# Altium schematic sheet Controller_v6.1.SchDoc
size Letter
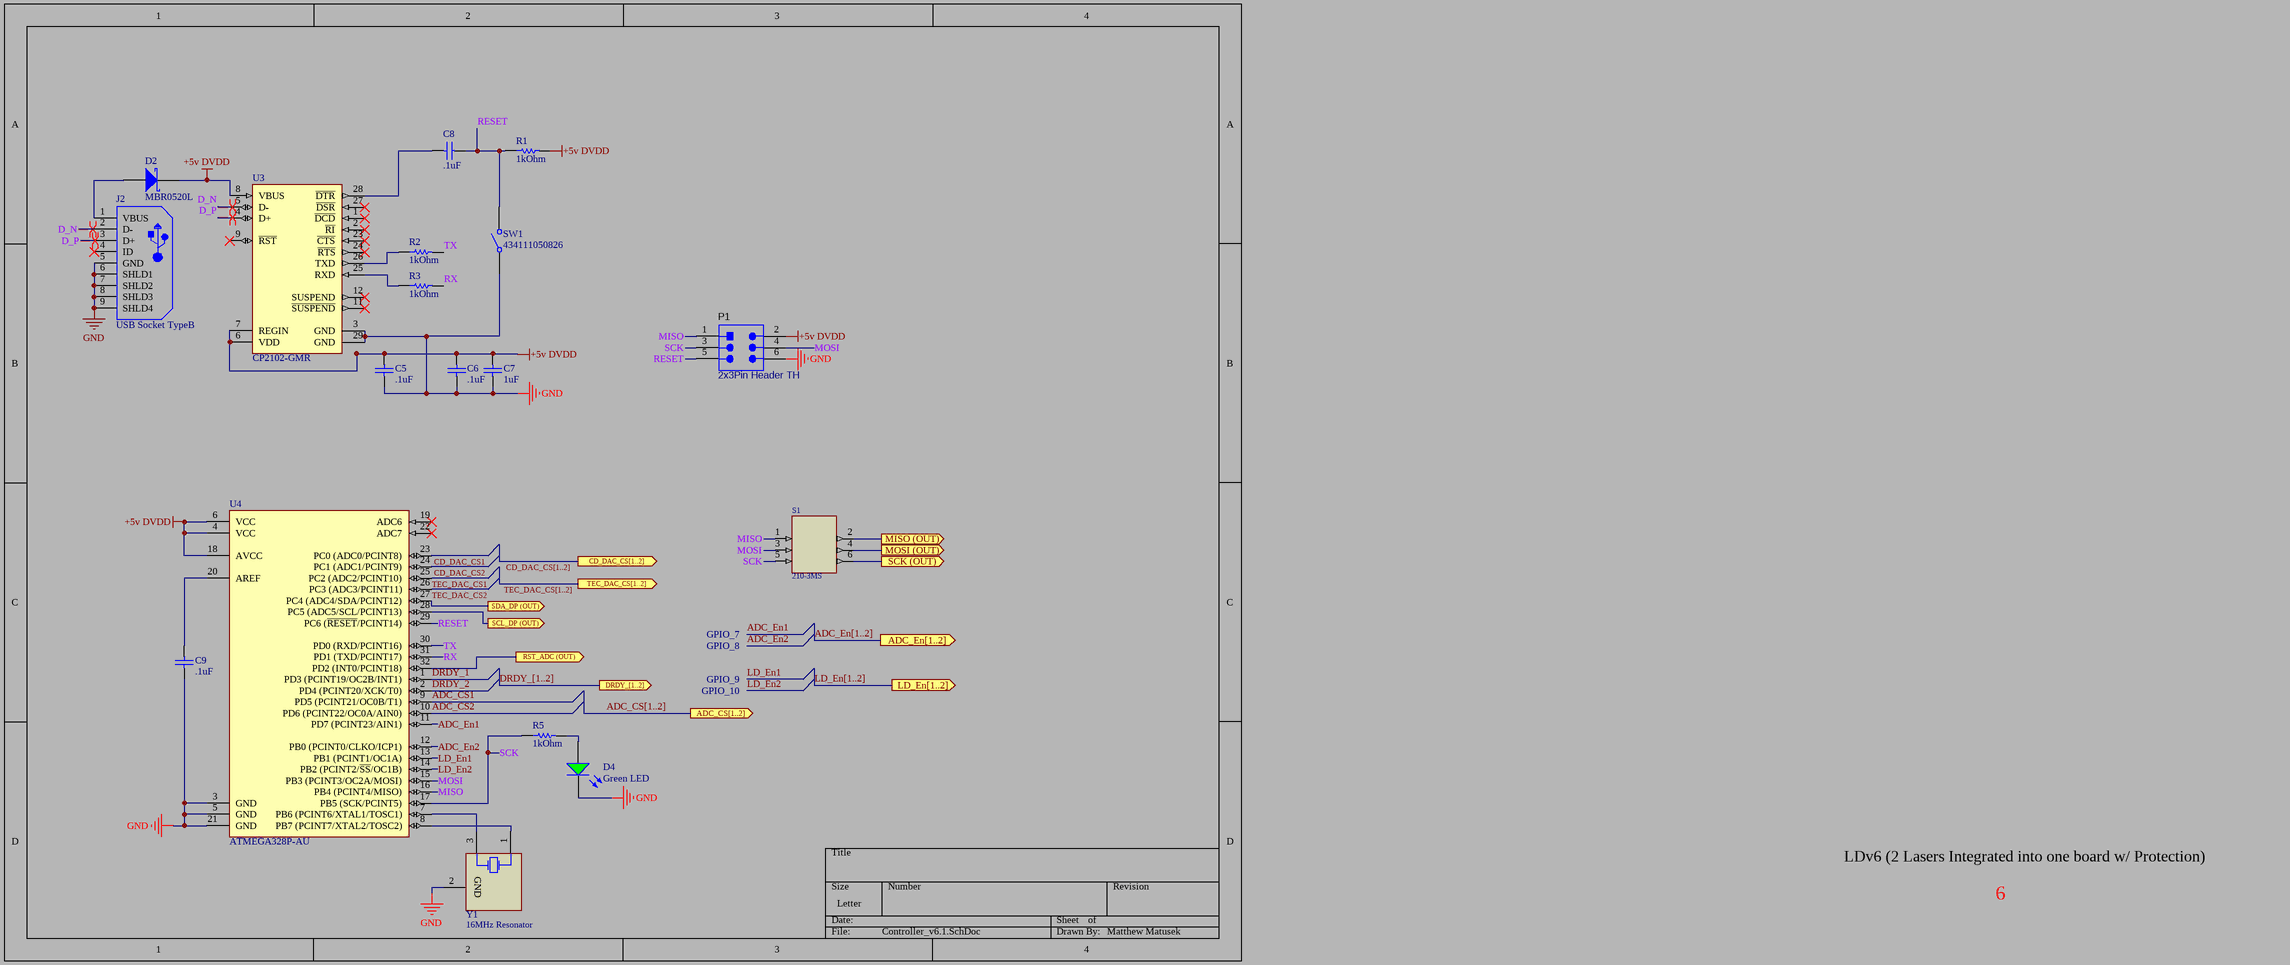
[diagram p0: Controller_v6.1.SchDoc]

## Parts
C5  .1uF  [CAPC1608X90X35ML15T15]
C6  .1uF  [CAPC1608X90X35ML15T15]
C7  1uF  [CAPC1608X90X35ML15T15]
C8  .1uF  [CAPC1608X90X35ML15T15]
C9  .1uF  [CAPC1608X90X35ML15T15]
D2  MBR0520L  [ONSC-SOD-123-2-425-04_V]
D4  Green LED  [LUMX-SML-LX0603_V]
J2  USB Socket TypeB  [WE-65100516121_V]
P1  2x3Pin Header TH  [SMTC-TSW-103-07-G-D_V]
R1  1kOhm  [RESC1609X50X30LL8T20]
R2  1kOhm  [RESC1609X50X30LL8T20]
R3  1kOhm  [RESC1609X50X30LL8T20]
R5  1kOhm  [RESC1609X50X30LL8T20]
S1  210-3MS  [210-3MS]
SW1  434111050826  [434111050826]
U3  CP2102-GMR  [SLAB-QFN-28-3125x3125TP_M]
U4  ATMEGA328P-AU  [32A_L]
Y1  16MHz Resonator  [MURA-CSTCE_V-3_V]

## Ports
ADC_CS[1..2] (out), ADC_En[1..2] (out), CD_DAC_CS[1..2] (out), DRDY_[1..2] (out), LD_En[1..2] (out), MISO (OUT) (out), MOSI (OUT) (out), RST_ADC (OUT) (out), SCK (OUT) (out), SCL_DP (OUT) (out), SDA_DP (OUT) (out), TEC_DAC_CS[1..2] (out)

## Nets
+5v DVDD: C5.2 C6.2 C7.2 D2.1(K) P1.2 R1.2 U3.6(VDD) U3.7(REGIN) U3.8(VBUS) U4.4(VCC) U4.6(VCC) U4.18(AVCC)
GND: C5.1 C6.1 C7.1 C9.1 D4.2(K) J2.5(GND) J2.6(SHLD1) J2.7(SHLD2) J2.8(SHLD3) J2.9(SHLD4) P1.6 SW1.1 U3.3(GND) U3.29(GND) U4.3(GND) U4.5(GND) U4.21(GND) Y1.2(GND)
ADC_CS1: U4.9(PD5_(PCINT21/OC0B/T1))
ADC_CS2: U4.10(PD6_(PCINT22/OC0A/AIN0))
ADC_En1: U4.11(PD7_(PCINT23/AIN1))
ADC_En2: U4.12(PB0_(PCINT0/CLKO/ICP1))
CD_DAC_CS1: U4.23(PC0_(ADC0/PCINT8))
CD_DAC_CS2: U4.24(PC1_(ADC1/PCINT9))
D_N: J2.2(D-) U3.5(D-)
D_P: J2.3(D+) U3.4(D+)
DRDY_1: U4.1(PD3_(PCINT19/OC2B/INT1))
DRDY_2: U4.2(PD4_(PCINT20/XCK/T0))
LD_En1: U4.13(PB1_(PCINT1/OC1A))
LD_En2: U4.14(PB2_(PCINT2/~{SS}/OC1B))
MISO: P1.1 S1.1 U4.16(PB4_(PCINT4/MISO))
MISO (OUT): S1.2 ; port MISO (OUT)
MOSI: P1.4 S1.3 U4.15(PB3_(PCINT3/OC2A/MOSI))
MOSI (OUT): S1.4 ; port MOSI (OUT)
RESET: C8.2 P1.5 R1.1 SW1.2 U4.29(PC6_(~{RESET}/PCINT14))
RST_ADC (OUT): U4.32(PD2_(INT0/PCINT18)) ; port RST_ADC (OUT)
RX: R3.2 U4.31(PD1_(TXD/PCINT17))
SCK: P1.3 R5.1 S1.5 U4.17(PB5_(SCK/PCINT5))
SCK (OUT): S1.6 ; port SCK (OUT)
SCL_DP (OUT): U4.28(PC5_(ADC5/SCL/PCINT13)) ; port SCL_DP (OUT)
SDA_DP (OUT): U4.27(PC4_(ADC4/SDA/PCINT12)) ; port SDA_DP (OUT)
TEC_DAC_CS1: U4.25(PC2_(ADC2/PCINT10))
TEC_DAC_CS2: U4.26(PC3_(ADC3/PCINT11))
TX: R2.2 U4.30(PD0_(RXD/PCINT16))
NetC8_1: C8.1 U3.28(~{DTR})
NetC9_2: C9.2 U4.20(AREF)
NetD2_2: D2.2(A) J2.1(VBUS)
NetD4_1: D4.1(A) R5.2
NetR2_1: R2.1 U3.26(TXD)
NetR3_1: R3.1 U3.25(RXD)
NetU4_7: U4.7(PB6_(PCINT6/XTAL1/TOSC1)) Y1.3(C2)
NetU4_8: U4.8(PB7_(PCINT7/XTAL2/TOSC2)) Y1.1(C1)

Not connected (* = marked no-connect by the designer): J2 4(ID)*; U3 1(~{DCD})* 2(~{RI})* 9(~{RST})* 11(~{SUSPEND})* 12(SUSPEND)* 23(~{CTS})* 24(~{RTS})* 27(~{DSR})*; U4 19(ADC6)* 22(ADC7)*

## Buses and harness runs
bus ADC_CS[1..2] = port ADC_CS[1..2]
bus ADC_En[1..2] = port ADC_En[1..2]
bus CD_DAC_CS[1..2] = port CD_DAC_CS[1..2]
bus DRDY_[1..2] = port DRDY_[1..2]
bus LD_En[1..2] = port LD_En[1..2]
bus TEC_DAC_CS[1..2] = port TEC_DAC_CS[1..2]

## Layout directives
differential pair: D_N, D_P

## Notes on the sheet
- GPIO_7
- GPIO_8
- GPIO_9
- GPIO_10
- LDv6 (2 Lasers Integrated into one board w/ Protection)
- 6
- Matthew Matusek

## Library data of the parts
C5 C6 C8 C9 = CMP-2006-04192-1: Part Number: 06033D104MAT2A; Manufacturer: AVX Interconnect / Elco
C7 = CMP-2006-04474-1: Part Number: 06036D105KAT2A; Manufacturer: AVX Interconnect / Elco
D2 = CMP-2000-04926-1: Schottky Diode, 20V, 0.2A, 2-pin SOD-123, RoHS, Tape and Reel; Manufacturer: FairchildSemiconductor; Peak Forward Voltage: 0.385V; Rad Hard: No; Peak Non-Repetitive Surge Current: 5.5A; Peak Average Forward Current: 0.5A; Peak Reverse Current: 250uA; Configuration: Single; Mounting: SurfaceMount; Operating Temperature: -65to125degC; Datasheet URL: https://datasheet.ciiva.com/5739/1684450-5739282.pdf; Package Reference: SOD-123-2-425-04; Package Description: 2-Pin Small Outline Diode, Body 2.69 x 1.6 mm; Type: SchottkyDiode; Datasheet Version: Rev. C0, 03/2012; Manufacturer URL: https://www.fairchildsemi.com/; Peak Reverse Repetitive Voltage: 20V; Package: 2SOD-123; Packaging: Tape&Reel; Category: Rectifier
D4 = CMP-2000-07120-1: LED Green Diode, 18 mcd, 50 mW, -25 to 85 degC, 2-Pin SMD, RoHS, Tape and Reel; Manufacturer: Lumex; Part No: SML-LX0603GW-TR; Peak Wavelength: 565nm; Viewing Angle: 160; LED Material: GaP; COO: CN; Lens Appearance: ColorlessDiffused; Pin_Count: 2; Type: Uni-Color; Intensity: 18mcd; Number of LEDs: 1; Reverse Voltage: 5(Min)V; Supplier: Lumex; ECCN: EAR99; Packaging: TapeandReel; Supplier Standard Pack: 4,000; Mounting: SurfaceMount; Operating Temperature: -25to85C; Package Description: 2-Pin Surface Mount Device, Body 1.6 x 0.8 mm; Family: SML-LX0603GW; Lens Dimensions: 1x0.8x0.3mm; Dominant Wavelength: N/A; Package Reference: SML-LX00603; HTS: 8541402000; Mounting Technology: SurfaceMount; Datasheet Version: Rev. G, 09/2013; Manufacturer URL: http://www.lumexinstruments.com/; RoHS: Yes; Datasheet URL: http://www.lumex.com/content/files/ProductAttachment/SML-LX0603GW-TR.pdf; Supplier_Package: SMD; Color: Green; Dimension: 1.6x0.8x0.6mm
J2 = CMP-2000-05576-1: MINI USB 2.0 SMT Type B 5 Contacts, 30 V, -40 to 105 degC, RoHS, Tape and Reel; Manufacturer: Wuerth Elektronik; Package Description: 5-Pin Surface Mount Device, Body 9.6 x 9.25 mm, Pitch 0.8 mm; Mounting Technology: SurfaceMount; Package Reference: 65100516121; Manufacturer URL: https://www.we-online.com/; Datasheet Version: Rev. H, 02/2013; Datasheet URL: https://datasheet.ciiva.com/4598/65100516121-83749-4598775.pdf
P1 = CMP-2000-07329-1: Through Hole Header, Pitch 2.54 mm, 2 x 3 Position, Height 8.58 mm, Tail Length 2.54 mm, -55 to 125 degC, RoHS, Bulk; Manufacturer: Samtec-Inc.; Number of Positions Loaded: All; Number of Positions: 6; Row Spacing: 0.100"(2.54mm); Connector Type: Header,Unshrouded; Package Reference: TSW-103-07-G-D; Termination: Solder; Manufacturer URL: http://www.samtec.com/; Contact Finish: Gold; Contact Mating Length: 0.230"(5.84mm); Package Description: Through Hole Header, Pitch 2.54 mm, 2 x 3 Position, Height 8.58 mm, Tail Length 2.54 mm; Datasheet Version: 12/2015; Number of Rows: 2; Features: -; Family: RectangularConnectors-Headers,MalePins; Fastening Type: -; Datasheet URL: http://suddendocs.samtec.com/catalog_english/tsw_th.pdf; Category: Connectors,Interconnects; Package URL: http://suddendocs.samtec.com/prints/tsw-xxx-xx-xxx-x-xx-xxx-mkt.pdf; Mounting Type: ThroughHole; Contact Finish Thickness: 10µin(0.25µm); Packaging: Bulk; Color: Black; Pitch: 0.100"(2.54mm); Series: TSW; Contact Type: MalePin; Mounting Technology: ThroughHole
R1-R3 R5 = CMP-1666-00003-4: Chip Resistor, 1 KOhm, +/- 1%, 0.1 W, -55 to 155 degC, 0603 (1608 Metric), RoHS, Tape and Reel; Manufacturer: Vishay Semiconductor; DatasheetVersion: 06/2012; ComponentLink1URL: http://www.vishay.com/; ComponentLink2Description: Datasheet; PackageDescription: 2-Pin Surface Mount Device, Body 1.575 x 0.85 mm; Mounting Technology: Surface Mount; ComponentLink1Description: Manufacturer URL; ComponentLink2URL: http://www.vishay.com/docs/20035/dcrcwe3.pdf; PackageReference: 0603
S1 = 210-3MS: 3 Position Switch, TH; ComponentLink1Description: DataSheet; ComponentLink1URL: https://www.ctscorp.com/wp-content/uploads/209-210.pdf
SW1 = CMP-1459-00003-1: WS-TASV SMD Tact Switch 6.0X3.5 mm; Manufacturer: Wuerth Elektronik; NoPins: 02; ComponentLink2URL: http://katalog.we-online.de/em/datasheet/434111050826.pdf; PackageReference: 434111050826; ComponentLink2Description: Datasheet; PartNumber: 434111050826; ComponentLink1URL: http://www.we-online.com; ComponentLink1Description: Manufacturer URL
U3 = CMP-2000-04924-1: Single-Chip USB to URAT Bridge, 3.3 V, -40 to 85 degC, 28-Pin QFN, RoHS, Tape and Reel; Manufacturer: Silicon Labs; Interface Circuit Standard 1: RS-232; Transmitter and Receiver FIFO Counter: No; Supply Current: 26mA; Operating Supply Voltage (Min): 3V; Operating Supply Voltage (Typ): 3.3V; Data Rate: 1000kbps; Operating Supply Voltage (Max): 3.6V; Number of Channels: 1; Package URL: http://www.silabs.com/Support%20Documents/TechnicalDocs/C8051T61x.pdf; Operating Temperature (Max): 85C; Datasheet URL: http://www.mouser.com/ds/2/368/CP2102-9-247052.pdf; Operating Temperature Classification: Industrial; Operating Temperature (Min): -40C; Package Description: 28-Pin Quad-Flat No-Leads Package, Body 5 x 5 mm, Pitch 0.5 mm; Manufacturer URL: http://www.silabs.com/; Rad Hardened: No; Package Reference: QFN-28; Pin Count: 28; Packaging: TapeandReel; Mounting: SurfaceMount; Package Type: QFNEP; Datasheet Version: Rev. 1.6, 12/2013
U4 = CMP-0095-00269-2: 8-bit AVR Microcontroller, 32KB Flash, 1KB EEPROM, 2KB SRAM, 32-pin TQFP, Industrial Grade (-40°C to 85°C); PackageDescription: 32-Lead, 7x7x1.0 mm Body, 0.8mm Lead Pitch, Thin Profile Plastic Quad Flat Package (TQFP); DatasheetVersion: revD, May-2011; RevisionNote: DatasheetVersion & PackageVersion updated. URLs added.; ComponentLink1URL: http://www.atmel.com/; ComponentLink2Description: ATmega48A/48PA/88A/88PA/168A/168PA/328/328P Datasheet; Code_JEDEC: MS-026-ABA; ComponentLink1Description: Manufacturer URL; PackageReference: 32A; ComponentLink3Description: ATmega48A/48PA/88A/88PA/168A/168PA/328/328P Summary; ComponentLink2URL: http://www.atmel.com/dyn/resources/prod_documents/doc8271.pdf; PackageVersion: revC, Oct-2010; ComponentLink3URL: http://www.atmel.com/dyn/resources/prod_documents/8271S.pdf
Y1 = CMP-0588-00001-2: Ceramic Resonator, 16 MHz with Built-in Capacitance, Thickness Expander Mode, Initial Frequency Tolerance +/- 0.5%, Load Capacity 15 pF, -20 to 80 degC, 3.2 x 1.3 x 1 mm SMD, RoHS, Reel; Manufacturer: Murata; PartNumber: CSTCE16M0V53-R0; Load Capacity: 15 pF; PackageDescription: 3-Pin SMD, Body 3.2 x 1.3 mm, Pitch 0.95 mm; Mounting Technology: Surface Mount; ComponentLink1URL: http://www.murata.com/; Oscillating Frequency: 16 MHz; RoHS: TRUE; Packing: Reel; Initial Frequency Tolerance: +/- 0.5%; ComponentLink2Description: Datasheet; DatasheetVersion: Rev. P16E-22; PackageReference: CSTCE_V-3; Operating Temperature Range: -20 to 80 degC; ComponentLink2URL: http://www.murata.com/products/catalog/pdf/p16e.pdf; ComponentLink1Description: Manufacturer URL; Initial Tolerance: +/- 0.5%